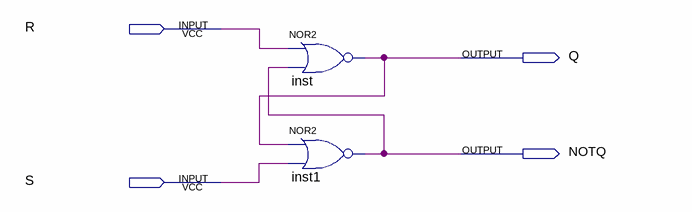
[diagram p0: schematic sheet]
// Quartus schematic lab_5_1.bdf as structural Verilog: 2 symbols, 4 pins
module lab_5_1 (
  input  R,
  input  S,
  output Q,
  output NOTQ
);

  nor inst (Q, R, NOTQ);
  nor inst1 (NOTQ, Q, S);
endmodule
